# Altium schematic sheet Accelerometer.SchDoc
size A4; SheetNumber: 3; SheetTotal: 5
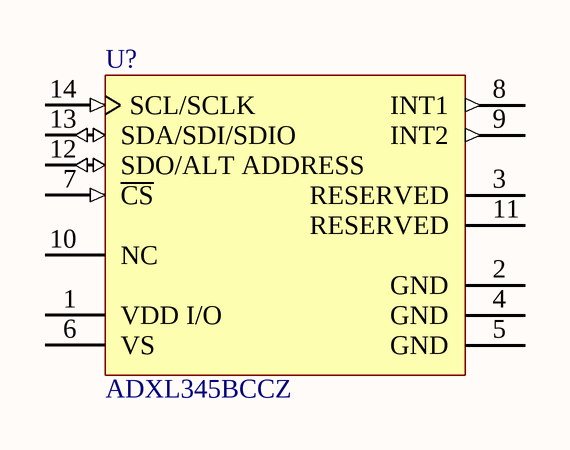
[diagram p0: Accelerometer.SchDoc]

## Parts
U?  ADXL345BCCZ  [ADI-CC-14-1_V]

## Nets

Not connected (* = marked no-connect by the designer): U? 1(VDD_I/O) 2(GND) 3(RESERVED) 4(GND) 5(GND) 6(VS) 7(~{CS}) 8(INT1) 9(INT2) 10(NC) 11(RESERVED) 12(SDO/ALT_ADDRESS) 13(SDA/SDI/SDIO) 14(SCL/SCLK)

## Library data of the parts
U? = CMP-0885-00027-1: 3-Axis, +/-2 g / +/-4 g / +/-8 g / +/-16 g Digital Accelerometer with Digital Output, 1.6 KHz BW, Industrial, 14-pin LGA, Tray; Manufacturer: Analog Devices; Sensitivity: 256/128/64/32 LSB/g; Voltage Supply (V): 2.0 to 3.6; Supply Current: 140 uA; # of Axes: 3; -3dB Bandwidth: 1.6 KHz; PackageReference: CC-14-1; ComponentLink1Description: Manufacturer URL; Packing: Tray; ComponentLink4URL: http://www.analog.com/en/mems-sensors/mems-inertial-sensors/adxl345/products/product.html; ComponentLink2URL: http://www.analog.com/static/imported-files/data_sheets/ADXL345.pdf; Mounting Technology: Surface Mount; ComponentLink3URL: http://www.analog.com/static/imported-files/data_sheets/ADXL343.pdf; PartNumber: ADXL345BCCZ; ComponentLink4Description: Product URL; Output Type: Digital; ComponentLink3Description: Package Specification; DatasheetVersion: Rev. D; PackageVersion: 03-16-2010-A, 03/2010; ComponentLink1URL: http://www.analog.com/en/index.html; ComponentLink2Description: Datasheet; PackageDescription: 14-Pin Land Grid Array, 3 x 5 mm Body, 0.8 mm Pitch